# Altium schematic sheet 11_Watchdog.SchDoc
size A4
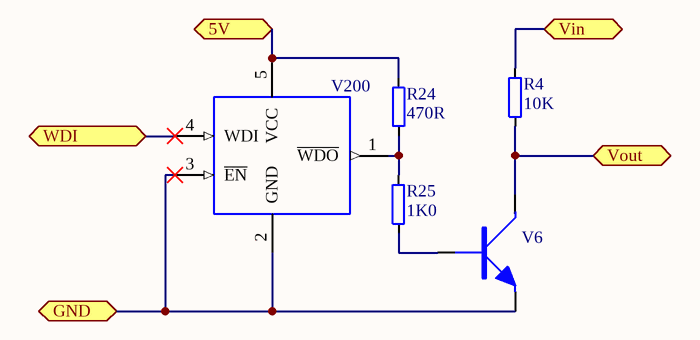
[diagram p0: 11_Watchdog.SchDoc]

## Parts
R4  10K  [1206]
R24  470R  [1206]
R25  1K0  [1206]
V6  BC846B  [SOT23]  (value not drawn)
V200  STWD100NYWY3F  [SOT23-5]  (value not drawn)

## Ports
5V, GND, Vin, Vout, WDI

## Nets
5V: R24.1 V200.5(VCC) ; port 5V
GND: V6.y(Emitter) V200.2(GND) V200.3(~{EN}) ; port GND
Vin: R4.2 ; port Vin
Vout: R4.1 V6.x(Collector) ; port Vout
WDI: V200.4(WDI) ; port WDI
NetR24_2: R24.2 R25.2 V200.1(~{WDO})
NetR25_1: R25.1 V6.z(Base)

## Library data of the parts
R4 = 3867: Resistor; Part Field 1: RES 10K 1% 250mW 1206 RoHS; Manufacturer: Phycomp; PartNumber: RC1206FR-0710KL; IPN: 3867; EndOfLife: Active EOL:Jan 2031; Characteristics: 100ppm/C -55..+155C U=150Vrms Reel=5000pcs; OrderNumber: 232272461003L; Lead_Process_Compatible: Yes; SubmittedBy: ART; DeviceRank: 2; Part Field 2: Phycomp RC1206FR-0710KL; ComponentLink1Description: Phycomp_RC1206series_DS.pdf; ComponentLink2Description: Phycomp_Generic_RCS.pdf; ComponentLink1URL: http://ecad.vsl.com.au/apps/BomGen/Data/rel/datasheets/new_parts/Phycomp_RC1206series_DS.pdf; ComponentLink2URL: http://ecad.vsl.com.au/apps/BomGen/Data/rel/rohs_compliance/new_certificates/Phycomp_Generic_RCS.pdf; Altium_Comment_Old: RES 10K 1% 250mW 1206 RoHS; Altium_Comment: 10K; Symbol: RES; Supplier1: Arrow; Supplier1_PartNumber: RC1206FR-0710KL; Supplier2: Xon; IPN_Search: 3867; PartType: PCB; CheckedBy: ART; Price_5000: M$0.004
R24 = 3835: Resistor; Part Field 1: RES 470R 1% 250mW 1206 RoHS; Manufacturer: Phycomp; PartNumber: RC1206FR-07470RL; IPN: 3835; EndOfLife: Active EOL:Jan 2023; Characteristics: 100ppm/C -55..+155C U=150Vrms Reel=5000pcs; OrderNumber: 232272464701L; Lead_Process_Compatible: Yes; SubmittedBy: ART; DeviceRank: 2; Part Field 2: Phycomp RC1206FR-07470RL; ComponentLink1Description: Phycomp_RC1206series_DS.pdf; ComponentLink2Description: Phycomp_Generic_RCS.pdf; ComponentLink1URL: http://ecad.vsl.com.au/apps/BomGen/Data/rel/datasheets/new_parts/Phycomp_RC1206series_DS.pdf; ComponentLink2URL: http://ecad.vsl.com.au/apps/BomGen/Data/rel/rohs_compliance/new_certificates/Phycomp_Generic_RCS.pdf; Altium_Comment_Old: RES 470R 1% 250mW 1206 RoHS; Altium_Comment: 470R; Symbol: RES; Supplier1: Arrow; Supplier1_PartNumber: RC1206FR-07470RL; Supplier2: Xon; IPN_Search: 3835; PartType: PCB; CheckedBy: ART; Price_5000: M$0.004
R25 = 3843: Resistor; Part Field 1: RES 1K0 1% 250mW 1206 RoHS; Manufacturer: Phycomp; PartNumber: RC1206FR-071KL; IPN: 3843; EndOfLife: Active EOL:Jan 2031; Characteristics: 100ppm/C -55..+155C U=150Vrms Reel=5000pcs; OrderNumber: 232272461002L; Lead_Process_Compatible: Yes; SubmittedBy: ART; DeviceRank: 2; Part Field 2: Phycomp RC1206FR-071KL; ComponentLink1Description: Phycomp_RC1206series_DS.pdf; ComponentLink2Description: Phycomp_Generic_RCS.pdf; ComponentLink1URL: http://ecad.vsl.com.au/apps/BomGen/Data/rel/datasheets/new_parts/Phycomp_RC1206series_DS.pdf; ComponentLink2URL: http://ecad.vsl.com.au/apps/BomGen/Data/rel/rohs_compliance/new_certificates/Phycomp_Generic_RCS.pdf; Altium_Comment_Old: RES 1K0 1% 250mW 1206 RoHS; Altium_Comment: 1K0; Symbol: RES; Supplier1: Arrow; Supplier1_PartNumber: RC1206FR-071KL; Supplier2: Xon; IPN_Search: 3843; PartType: PCB; CheckedBy: ART; Price_5000: M$0.004
V6 = 3412: NPN Transistor SOT23; Part Field 1: BJT NPN BC846 SOT23 RoHS; Manufacturer: NXP; IPN: 3412; EndOfLife: Active EOL:Nov 2023; Characteristics: Ic=100mA Vceo=65V Pt=250mW Tj=150degC Hfe=200..450; OrderNumber: 9335 895 60215; Lead_Process_Compatible: Yes; SubmittedBy: ART; DeviceRank: 1; Part Field 2: NXP BC846B; ComponentLink1Description: NXP_BC84xseries_DS.pdf; ComponentLink2Description: NXP_BC846B_MD.xls; ComponentLink1URL: http://ecad.vsl.com.au/apps/BomGen/Data/rel/datasheets/new_parts/NXP_BC84xseries_DS.pdf; ComponentLink2URL: Not Found; Altium_Comment_Old: BJT NPN BC846 SOT23 RoHS; Altium_Comment: BC846B; Symbol: NPN-SOT23; PartNumber: BC846B; LastChanged: 24/08/09 11:56:43; Supplier1: Mouser; Supplier1_PartNumber: 771-BC846B-T/R; Supplier2: Digikey; Supplier2_PartNumber: 568-1632-1-ND; IPN_Search: 3412; PartType: PCB; CheckedBy: LZZ; Price_100: M$0.040; Price_1000: M$0.027; Price_5000: M$0.020
V200 = 5674: IC Watchdog Timer Circuit; Part Field 1: Microprocessor Watchdog Timer STWD100NY; Manufacturer: ST Microelectronics; IPN: 5674; EndOfLife: Active EOL:Dec 2024; Characteristics: Open Drain Output 210ms; Lead_Process_Compatible: Yes; SubmittedBy: GRH; DeviceRank: 2; Part Field 2: ST Microelectronics STWD100NYWY3F; ComponentLink1Description: STWD100.pdf; ComponentLink2Description: ROHSSTWD100NYWY3F.pdf; ComponentLink1URL: http://ecad.vsl.com.au/apps/BomGen/Data/rel/datasheets/new_parts/STWD100.pdf; ComponentLink2URL: http://ecad.vsl.com.au/apps/BomGen/Data/rel/rohs_compliance/new_certificates/ROHSSTWD100NYWY3F.pdf; Altium_Comment_Old: Microprocessor Watchdog Timer STWD100NY; Altium_Comment: STWD100NYWY3F; Symbol: STWD100; PartNumber: STWD100NYWY3F; LastChanged: 20/04/11 08:20:11; Supplier1: Digikey; Supplier1_PartNumber: 497-10058-1-ND; IPN_Search: 5674; PartType: PCB; Price: 1.40 (USD); CheckedBy: SAA; Price_100: M$0.611; Price_1000: M$0.426; Price_5000: M$0.378